# Altium schematic sheet Port.SchDoc
size A4
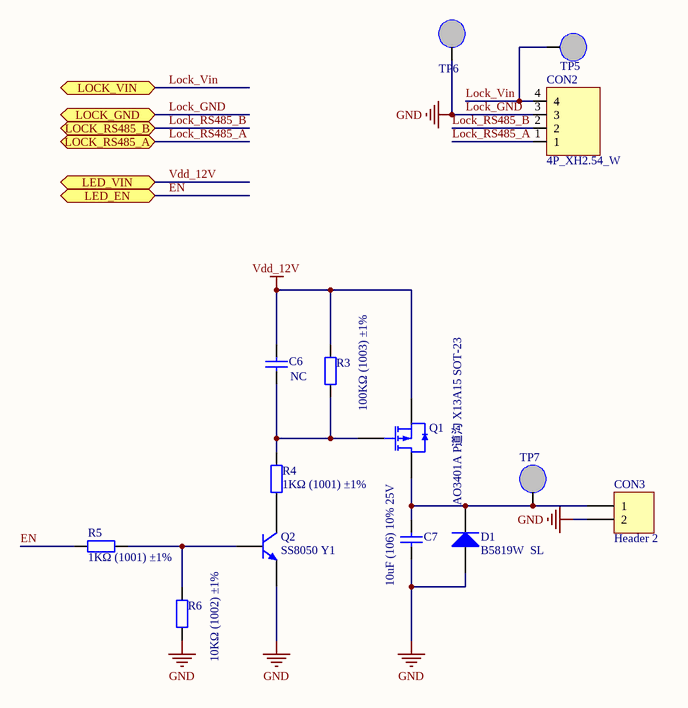
[diagram p0: Port.SchDoc]

## Parts
C6  NC  [0805_C]
C7  10uF (106) 10% 25V  [0805_C]
CON2  4P_XH2.54_W  [XH2.54-LS-4P]
CON3  Header 2  [PH2.0-LS-2P]
D1  B5819W  SL  [SOD-123]
Q1  AO3401A P道沟 X13A15 SOT-23  [SOT-23-3L]
Q2  SS8050 Y1  [SOT-23(SOT-23-3)]
R3  100KΩ (1003) ±1%  [0805_R]
R4  1KΩ (1001) ±1%  [0805_R]
R5  1KΩ (1001) ±1%  [0805_R]
R6  10KΩ (1002) ±1%  [0805_R]
TP5  TP  [TP]  (value not drawn)
TP6  TP  [TP]  (value not drawn)
TP7  TP  [TP]  (value not drawn)

## Ports
LED_EN, LED_VIN, LOCK_GND, LOCK_RS485_A, LOCK_RS485_B, LOCK_VIN

## Nets
Lock_GND: C7.1 CON2.3 CON3.2 D1.1(A) Q2.2(E) R6.1 TP6.1 ; port LOCK_GND  [also labelled GND]
Vdd_12V: C6.2 Q1.2(S) R3.2 ; port LED_VIN
EN: R5.1 ; port LED_EN
Lock_RS485_A: CON2.1 ; port LOCK_RS485_A
Lock_RS485_B: CON2.2 ; port LOCK_RS485_B
Lock_Vin: CON2.4 TP5.1 ; port LOCK_VIN
NetC6_1: C6.1 Q1.1(G) R3.1 R4.1
NetC7_2: C7.2 CON3.1 D1.2(K) Q1.3(D) TP7.1
NetQ2_1: Q2.1(B) R5.2 R6.2
NetQ2_3: Q2.3(C) R4.2

Not connected (* = marked no-connect by the designer): CON2 A B

## Library data of the parts
C6 = 0805 22uF (226) 20% 25V: 贴片电容; ComponentLink1Description: 供应商链接; ComponentLink1URL: http://www.szlcsc.com/product/details_46786.html; Package: 0805; Supplier: LC; SuppliersPartNumber: C45783
C7 = 0805 10uF (106) 10% 25V: 贴片电容; ComponentLink1Description: 供应商链接; ComponentLink1URL: http://www.szlcsc.com/product/details_16532.html; Package: 0805; Supplier: LC; SuppliersPartNumber: C15850
CON3 = Header 2: Header, 2-Pin; LatestRevisionDate: 17-Jul-2002; LatestRevisionNote: Re-released for DXP Platform.; Publisher: Altium Limited
D1 = SOD-123 B5819W  SL: 肖特基二极管; ComponentLink1Description: 供应商链接; ComponentLink1URL: http://www.szlcsc.com/product/details_9093.html; Package: SOD-123; Supplier: LC; SuppliersPartNumber: C8598
Q1 = AO3401A P道沟 X13A15 SOT-23: MOS(场效应管); ComponentLink1Description: 供应商链接; ComponentLink1URL: http://www.szlcsc.com/product/details_15801.html; Package: SOT-23; Supplier: LC; SuppliersPartNumber: C15127
Q2 = SOT-23 SS8050 Y1: 三极管; ComponentLink1Description: 供应商链接; ComponentLink1URL: http://www.szlcsc.com/product/details_2507.html; Package: SOT-23; Supplier: LC; SuppliersPartNumber: C2150
R3 = 0805 100KΩ (1003) 1%: 贴片电阻; ComponentLink1Description: 供应商链接; ComponentLink1URL: http://www.szlcsc.com/product/details_18095.html; Package: 0805; Supplier: LC; SuppliersPartNumber: C17407
R4 R5 = 0805 1KΩ (1001) 1%: 贴片电阻; ComponentLink1Description: 供应商链接; ComponentLink1URL: http://www.szlcsc.com/product/details_18201.html; Package: 0805; Supplier: LC; SuppliersPartNumber: C17513
R6 = 0805 10KΩ (1002) 1%: 贴片电阻; ComponentLink1Description: 供应商链接; ComponentLink1URL: http://www.szlcsc.com/product/details_18102.html; Package: 0805; Supplier: LC; SuppliersPartNumber: C17414